# EAGLE design DCU (EAGLE 6.4)
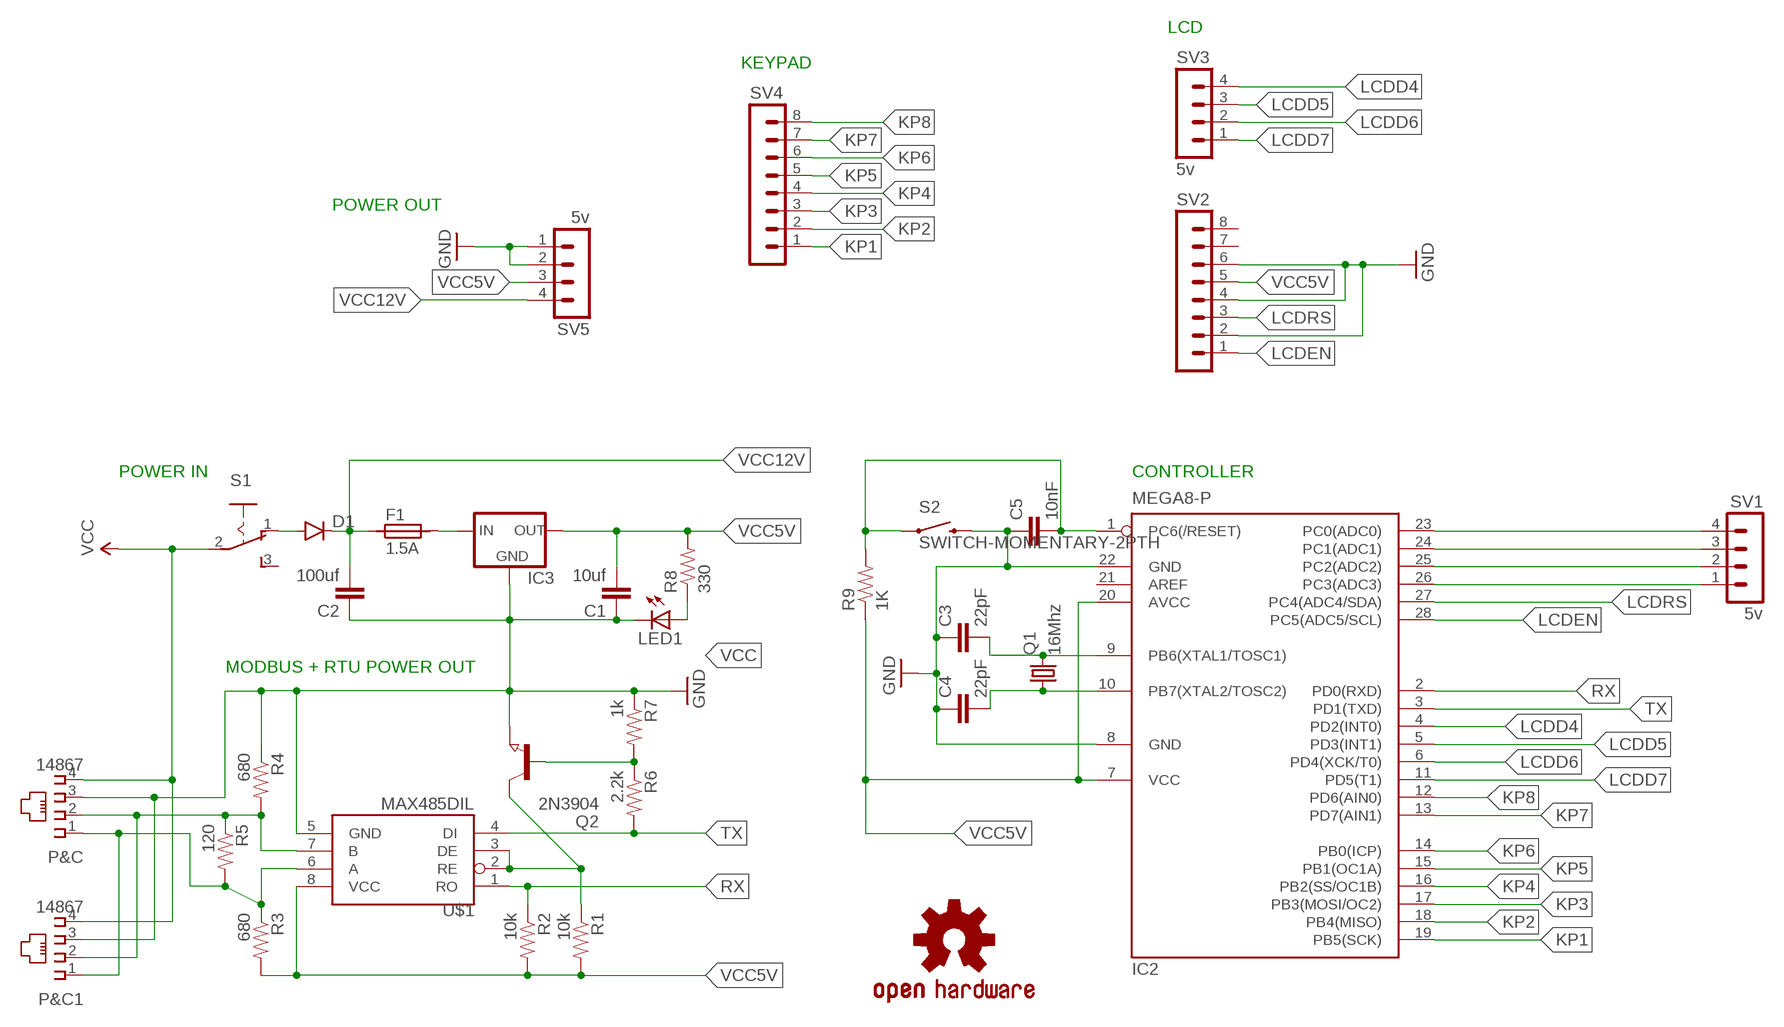
[diagram p0: schematic, sheet 1]

## Parts
C1  10uf  CAP0805  [0805]
C2  100uf  CAP0805  [0805]
C3  22pF  CAP0805  [0805]
C4  22pF  CAP0805  [0805]
C5  10nF  CAP0805  [0805]
D1  DIODESMA  [SMA-DIODE]
F1  1.5A  SIBA194600  [1820]
IC2  MEGA8-P  [DIL28-3]
IC3  V_REG_78XX-TO-220  [TO-220-ALT]
LED1  LEDCHIP-LED0805  [CHIP-LED0805]
LOGO1  OSHW-LOGOL  [OSHW-LOGO-L]
P&C  14867  [14867]
P&C1  14867  [14867]
Q1  16Mhz  CRYSTALSM49  [SM49]
Q2  2N3904  NPN-TRANSISTOR_SOT23  [SOT23]
R1  10k  RESISTOR0805-RES  [0805]
R2  10k  RESISTOR0805-RES  [0805]
R3  680  RESISTOR0805-RES  [0805]
R4  680  RESISTOR0805-RES  [0805]
R5  120  RESISTOR0805-RES  [0805]
R6  2.2k  RESISTOR0805-RES  [0805]
R7  1k  RESISTOR0805-RES  [0805]
R8  330  RESISTOR0805-RES  [0805]
R9  1K  RESISTOR0805-RES  [0805]
S1  255SB  [255SB]
S2  SWITCH-MOMENTARY-2PTH  [TACTILE-PTH]
SV1  5v  MA04-1  [MA04-1]
SV2  MA08-1  [MA08-1]
SV3  5v  MA04-1  [MA04-1]
SV4  MA08-1  [MA08-1]
SV5  5v  MA04-1  [MA04-1]
U$1  MAX485DIL  [DIL08]

## Nets
GND: C1.1 C2.1 C3.1 C4.1 C5.1 IC2.8(GND) IC2.22(GND) IC3.GND LED1.C P&C1.3 P&C.3 Q2.2(E) R4.1 R7.1 S2.3 SV2.2 SV2.4 SV2.6 SV5.1 SV5.2 U$1.5(GND)
KP1: IC2.19(PB5(SCK)) SV4.1
KP2: IC2.18(PB4(MISO)) SV4.2
KP3: IC2.17(PB3(MOSI/OC2)) SV4.3
KP4: IC2.16(PB2(SS/OC1B)) SV4.4
KP5: IC2.15(PB1(OC1A)) SV4.5
KP6: IC2.14(PB0(ICP)) SV4.6
KP7: IC2.13(PD7(AIN1)) SV4.7
KP8: IC2.12(PD6(AIN0)) SV4.8
LCDD4: IC2.4(PD2(INT0)) SV3.4
LCDD5: IC2.5(PD3(INT1)) SV3.3
LCDD6: IC2.6(PD4(XCK/T0)) SV3.2
LCDD7: IC2.11(PD5(T1)) SV3.1
LCDEN: IC2.28(PC5(ADC5/SCL)) SV2.1
LCDRS: IC2.27(PC4(ADC4/SDA)) SV2.3
N$1: F1.2 IC3.IN
N$2: Q2.3(C) R1.1 U$1.2(RE) U$1.3(DE)
N$4: Q2.1(B) R6.1 R7.2
N$5: IC2.26(PC3(ADC3)) SV1.1
N$7: P&C1.2 P&C.2 R4.2 R5.1 U$1.7(B)
N$8: P&C1.1 P&C.1 R3.1 R5.2 U$1.6(A)
N$11: LED1.A R8.1
N$13: D1.A S1.1(O)
N$15: IC2.25(PC2(ADC2)) SV1.2
N$16: IC2.24(PC1(ADC1)) SV1.3
N$17: IC2.23(PC0(ADC0)) SV1.4
N$21: C3.2 IC2.9(PB6(XTAL1/TOSC1)) Q1.2
N$23: C4.2 IC2.10(PB7(XTAL2/TOSC2)) Q1.1
N$24: C5.2 IC2.1(PC6(/RESET)) R9.2 S2.1
RX: IC2.2(PD0(RXD)) R2.1 U$1.1(RO)
TX: IC2.3(PD1(TXD)) R6.2 U$1.4(DI)
VCC: P&C1.4 P&C.4 S1.2(P)
VCC5V: C1.2 IC2.7(VCC) IC2.20(AVCC) IC3.OUT R1.2 R2.2 R3.2 R8.2 R9.1 SV2.5 SV5.3 U$1.8(VCC)
VCC12V: C2.2 D1.C F1.1 SV5.4
Unconnected: IC2.21(AREF) S1.3(S) SV2.7 SV2.8

## Notes on the sheet
- LCD
- KEYPAD
- POWER OUT
- POWER IN | CONTROLLER
- MODBUS + RTU POWER OUT

## Library data of the parts
C1-C5 = SparkFun-Capacitors:CAP: Capacitor Standard 0603 ceramic capacitor, and 0.1" leaded capacitor.
D1 = SparkFun-DiscreteSemi:DIODE: Diode These are standard reverse protection diodes and small signal diodes. SMA package can handle up to about 1A. SOD-323 can handle about 200mA. What the SOD-323 package when ordering, there are some mfgs out there that are 5-pin packages.
F1 = _hhn_PtcFuses_Siba_r500_Ozan:SIBA194600*: SIBA PTC-Fuses, Series 194600, 1812 (4.5 3.2)mm Source: www.siba.de/ Package: SMD 1812 (4.5 x 3.2)mm Technologies: SIBA194600Axxx xxx: Trip-Current * 10 mA Author: Dipl.-Ing. FH Rainer Bayer
IC2 = atmel:MEGA8-P: MICROCONTROLLER 8 Kbytes FLASH, 1 kbytes SRAM, 512 bytes EEPROM, USART, 4-channel 10 bit ADC, 2-channel 8 bit ADC Pin compatible with Atmega48, ATMega88, ATMega168 Source: avr.lbr; OC_FARNELL: unknown; OC_NEWARK: unknown
IC3 = SparkFun-PowerIC:V_REG_78XX: Voltage Regulator Standard 7805 5V regulator. IGO (Input Ground Output). Spark Fun Electronics SKU : COM-00107
LED1 = led:LED: LED OSRAM: - CHIPLED LG R971, LG N971, LY N971, LG Q971, LY Q971, LO R971, LY R971 LH N974, LH R974 LS Q976, LO Q976, LY Q976 LO Q996 - Hyper CHIPLED LW Q18S LB Q993, LB Q99A, LB R99A - SideLED LS A670, LO A670, LY A670, LG A670, LP A670 LB A673, LV A673, LT A673, LW A673 LH A674 LY A675 LS A676, LA A676, LO A676, LY A676, LW A676 LS A679, LY A679, LG A679 - Hyper Micro SIDELED® LS Y876, LA Y876, LO Y876, LY Y876 LT Y87S - SmartLED LW L88C, LW L88S LB L89C, LB L89S, LG L890 LS L89K, LO L89K, LY L89K LS L896, LA L896, LO L896, LY L896 - TOPLED LS T670, LO T670, LY T670, LG T670, LP T670 LSG T670, LSP T670, LSY T670, LOP T670, LYG T670 LG T671, LOG T671, LSG T671 LB T673, LV T673, LT T673, LW T673 LH T674 LS T676, LA T676, LO T676, LY T676, LB T676, LH T676, LSB T676, LW T676 LB T67C, LV T67C, LT T67C, LS T67K, LO T67K, LY T67K, LW E67C LS E67B, LA E67B, LO E67B, LY E67B, LB E67C, LV E67C, LT E67C LW T67C LS T679, LY T679, LG T679 LS T770, LO T770, LY T770, LG T770, LP T770 LB T773, LV T773, LT T773, LW T773 LH T774 LS E675, LA E675, LY E675, LS T675 LS T776, LA T776, LO T776, LY T776, LB T776 LHGB T686 LT T68C, LB T68C - Hyper Mini TOPLED® LB M676 - Mini TOPLED Santana® LG M470 LS M47K, LO M47K, LY M47K Source: http://www.osram.convergy.de LUXEON: - LUMILED® LXK2-PW12-R00, LXK2-PW12-S00, LXK2-PW14-U00, LXK2-PW14-V00 LXK2-PM12-R00, LXK2-PM12-S00, LXK2-PM14-U00 LXK2-PE12-Q00, LXK2-PE12-R00, LXK2-PE12-S00, LXK2-PE14-T00, LXK2-PE14-U00 LXK2-PB12-K00, LXK2-PB12-L00, LXK2-PB12-M00, LXK2-PB14-N00, LXK2-PB14-P00, LXK2-PB14-Q00 LXK2-PR12-L00, LXK2-PR12-M00, LXK2-PR14-Q00, LXK2-PR14-R00 LXK2-PD12-Q00, LXK2-PD12-R00, LXK2-PD12-S00 LXK2-PH12-R00, LXK2-PH12-S00 LXK2-PL12-P00, LXK2-PL12-Q00, LXK2-PL12-R00 Source: www.luxeon.com KINGBRIGHT: KA-3528ASYC Source: www.kingbright.com
LOGO1 = SparkFun-Aesthetics:OSHW-LOGO: Open Source Hardware Logo This logo indicates the piece of hardware it is found on incorporates a OSHW license and/or adheres to the definition of open source hardware found here: http://freedomdefined.org/OSHW
P&C P&C1 = con-4ucon:14867: RJ11 Connector Source: 4UCON TECHNOLOGY INC. 14867.pdf; OC_FARNELL: unknown; OC_NEWARK: unknown
Q1 = crystal:CRYSTAL: CRYSTAL; OC_FARNELL: unknown; OC_NEWARK: unknown
Q2 = semicon-smd-ipc:NPN-TRANSISTOR_: NPN TRANSISTOR
R1-R9 = SparkFun-Passives:RESISTOR: Resistor Basic schematic elements and footprints for 0603, 1206, and PTH resistors.
S1 = switch:255SB: SLIDING SWITCH Distributor Buerklin, 11G810
S2 = SparkFun-Electromechanical:SWITCH-MOMENTARY-2: Various NO switches- pushbuttons, reed, etc
SV1 SV3 SV5 = con-lstb:MA04-1: PIN HEADER; OC_FARNELL: unknown; OC_NEWARK: unknown
SV2 SV4 = con-lstb:MA08-1: PIN HEADER; OC_FARNELL: unknown; OC_NEWARK: unknown
U$1 = SparkFun-DigitalIC:MAX485: RS-485 transceiver

## Net classes
0 default: width 0.3 mm, drill 0.5 mm, clearance 0.25 mm

## Board
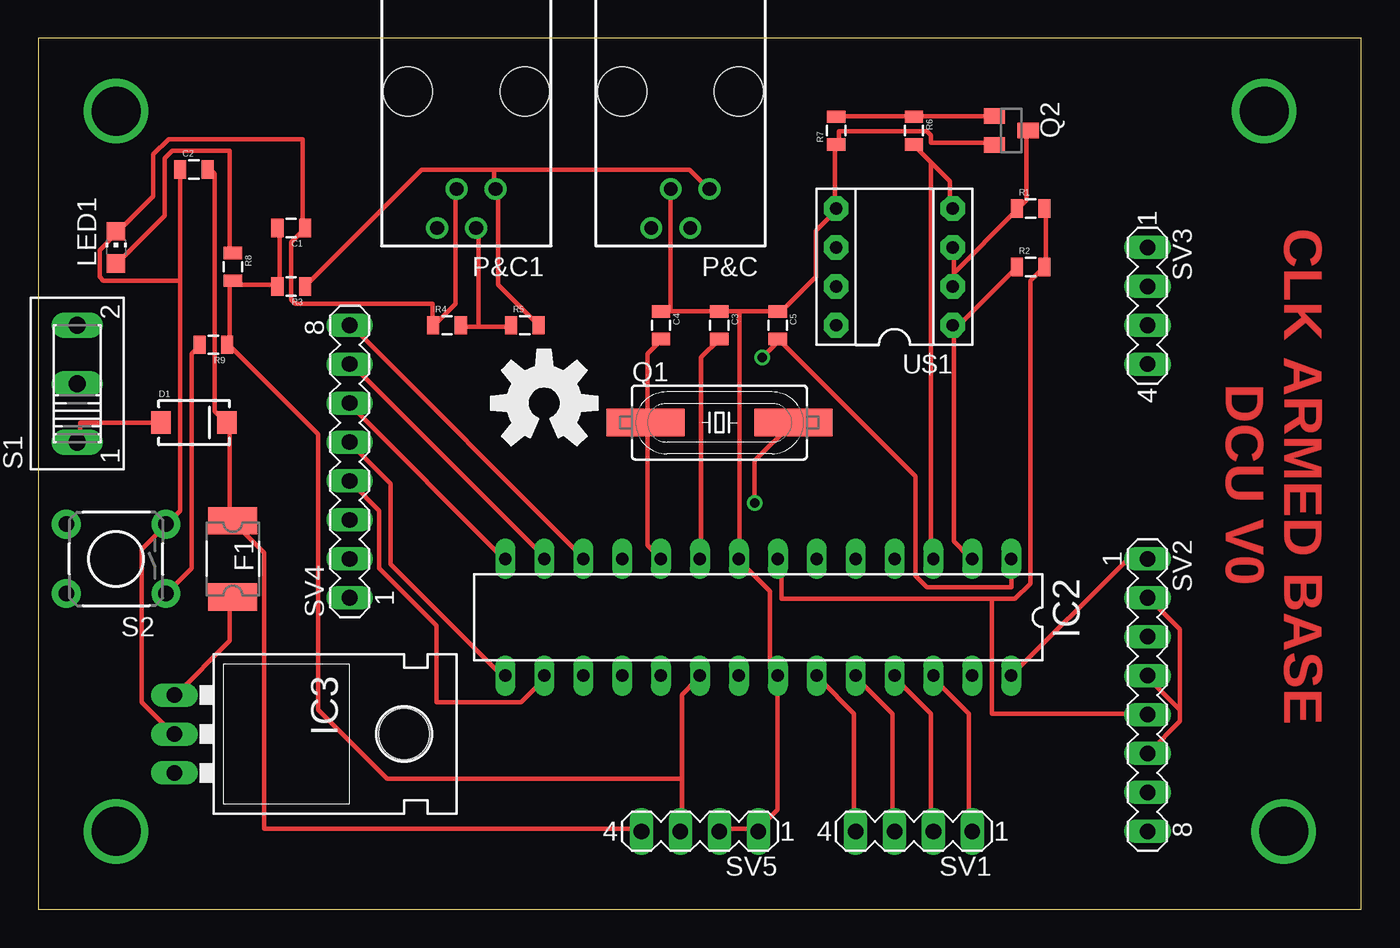
[diagram p1: board, top side]
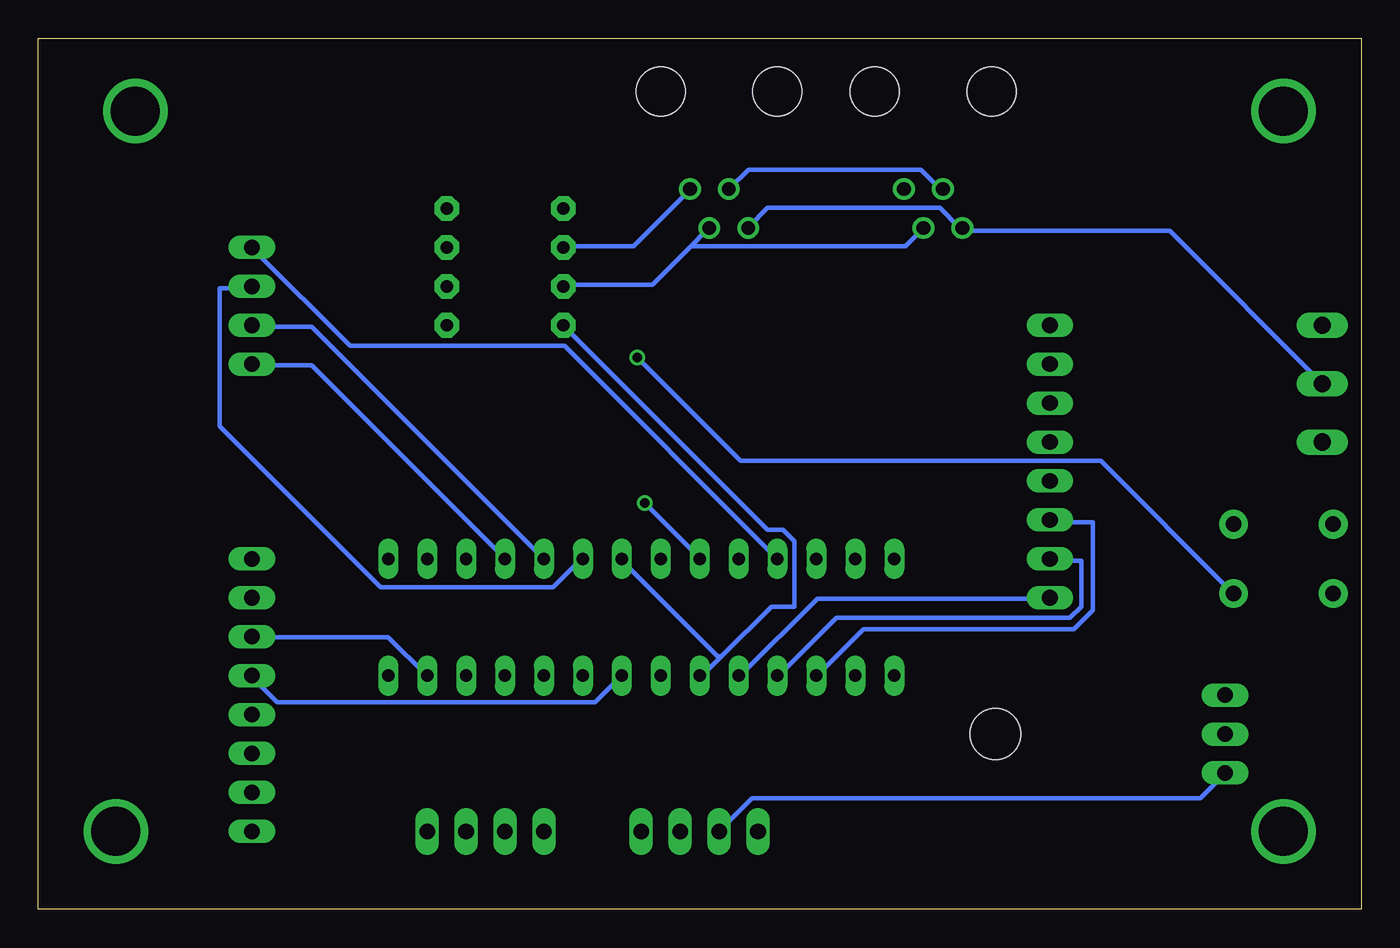
[diagram p2: board, bottom side, seen from below]

Size 86.34 x 56.82 mm. Coordinates in mm from the lower left corner, seen from the top.
Outline: 0,0 86.34,0 86.34,56.82 0,56.82 0,0
Copper layers (1*16): Top 0.035mm / dielectric 1.5mm / Bottom 0.035mm
Design rules "default": minimum track width 10mil, minimum drill 24mil, track to track 8mil, track to pad 8mil, pad to pad 8mil, via to via 8mil, smd to smd 8mil, copper to edge 40mil, drill to drill 8mil, minimum pad ring 10mil, minimum via ring 8mil, stop-mask expansion 4mil, vias tented up to drill 0mil, thermal gap 10mil

### Footprints (pad centres in the part's own frame; a part is rotated, then mirrored left to right if it is on the bottom)
0805 = smd 0.8 x 1.2: 1 -0.9,0; 2 0.9,0
SMA-DIODE = smd 1.27 x 1.47: A -2.15,0; C 2.15,0
1820 = smd 1.78 x 3.2: 1 -2.49,0; 2 2.49,0
DIL28-3 = drill 0.813 long: 1 -16.51,-3.81; 2 -13.97,-3.81; 3 -11.43,-3.81; 4 -8.89,-3.81; 5 -6.35,-3.81; 6 -3.81,-3.81; 7 -1.27,-3.81; 8 1.27,-3.81; 9 3.81,-3.81; 10 6.35,-3.81; 11 8.89,-3.81; 12 11.43,-3.81; 13 13.97,-3.81; 14 16.51,-3.81; 15 16.51,3.81; 16 13.97,3.81; 17 11.43,3.81; 18 8.89,3.81; 19 6.35,3.81; 20 3.81,3.81; 21 1.27,3.81; 22 -1.27,3.81; 23 -3.81,3.81; 24 -6.35,3.81; 25 -8.89,3.81; 26 -11.43,3.81; 27 -13.97,3.81; 28 -16.51,3.81
TO-220-ALT = drill 1.016 long: GND 0,-3.81; IN -2.54,-3.81; OUT 2.54,-3.81 | hole 3.302: 0,11.176
CHIP-LED0805 = smd 1.2 x 1.2: A 0,-1.05; C 0,1.05
14867 = drill 0.9 pad 1.422: 1 -1.905,6.35; 2 -0.635,8.89; 3 0.635,6.35; 4 1.905,8.89 | hole 3.2: -3.81,0; 3.81,0
SM49 = smd 5.08 x 1.778: 1 -4.826,0; 2 4.826,0
SOT23 = smd 1 x 1.4: 1 -0.95,-1.1; 2 0.95,-1.1; 3 0,1.1
255SB = drill 1.118 long: 1 -3.81,0; 2 0,0; 3 3.81,0
TACTILE-PTH = drill 1.016 pad 1.88: 1 -3.251,2.261; 2 3.251,2.261; 3 -3.251,-2.261; 4 3.251,-2.261
MA04-1 = drill 1.016 long: 1 -3.81,0; 2 -1.27,0; 3 1.27,0; 4 3.81,0
MA08-1 = drill 1.016 long: 1 -8.89,0; 2 -6.35,0; 3 -3.81,0; 4 -1.27,0; 5 1.27,0; 6 3.81,0; 7 6.35,0; 8 8.89,0
DIL08 = drill 0.813 pad 1.6 octagon: 1 -3.81,-3.81; 2 -1.27,-3.81; 3 1.27,-3.81; 4 3.81,-3.81; 5 3.81,3.81; 6 1.27,3.81; 7 -1.27,3.81; 8 -3.81,3.81

### Placement (x,y rotation side)
C1  16.51,44.45 180 top
C2  10.16,48.26 0 top
C3  44.45,38.1 270 top
C4  40.64,38.1 270 top
C5  48.26,38.1 270 top
D1  10.16,31.75 0 top
F1  12.7,22.86 270 top
IC2  46.99,19.05 180 top
IC3  12.7,11.43 270 top
LED1  5.08,43.18 0 top
LOGO1  33.02,33.02 0 top
P&C  41.91,53.34 180 top
P&C1  27.94,53.34 180 top
Q1  44.45,31.75 0 top
Q2  63.5,50.8 270 top
R1  64.77,45.72 0 top
R2  64.77,41.91 0 top
R3  16.51,40.64 180 top
R4  26.67,38.1 0 top
R5  31.75,38.1 0 top
R6  57.15,50.8 270 top
R7  52.07,50.8 90 top
R8  12.7,41.91 270 top
R9  11.43,36.83 180 top
S1  2.54,34.29 90 top
S2  5.08,22.86 180 top
SV1  57.15,5.08 180 top
SV2  72.39,13.97 270 top
SV3  72.39,39.37 270 top
SV4  20.32,29.21 90 top
SV5  43.18,5.08 180 top
U$1  55.88,41.91 90 top

### Tracks (layer width: path | path; a pad name or v marks a point on that pad's centre or on a via)
GND
  Top 0.3: 74.5,13 74.5,12.25 72.5,10.25 SV2.6 | 74.5,13 72.5,15 SV2.4 | 74.5,13 74.5,18.25 72.5,20.25 SV2.2 | SV5.2 44.5,5.25 46.75,5.25 SV5.1 47,5.25 48.25,6.5 48.25,15 IC2.22 47.75,15.75 47.75,20.75 45.75,22.75 IC2.8 45.75,23 45.75,39 | 9.25,41 4.25,41 4,41.25 4,43 5,44 LED1.C 5.25,44.25 7.5,46.5 7.5,49.25 8.5,50.25 17.25,50.25 17.25,44.5 C1.1 17.25,44.25 16.5,43.5 16.5,39.75 16.75,39.5 25.75,39.5 25.75,38.25 R4.1 26,38.25 27.25,39.5 27.25,46.75 P&C1.3 | 9.25,41 C2.1 | IC3.GND 8.75,11.5 6.75,13.5 6.75,23.5 8.25,25 S2.3 8.5,25.25 9.25,26 9.25,41 | 41.25,39 C3.1 45.75,39 | 41.25,39 C4.1 | 45.75,39 C5.1 48.5,39 50.75,41.25 50.75,44.25 52,45.5 U$1.5 52,45.75 52,49.75 R7.1 52.25,50 52.25,50.75 58,50.75 58.25,50.5 58.25,50 62.25,50 Q2.2 | 41.25,39 41.25,46.75 P&C.3
  Bottom 0.3: IC2.22 50,13.5 70.75,13.5 72.25,15 SV2.4 | P&C1.3 27.5,47 28.75,48.25 40,48.25 41.25,47 P&C.3
KP1
  Bottom 0.3: IC2.19 40.5,15.25 35.5,20.25 20.5,20.25 SV4.1
KP2
  Bottom 0.3: IC2.18 38,15.25 34.25,19 19,19 18.25,19.75 18.25,22.75 20.25,22.75 SV4.2
KP3
  Bottom 0.3: IC2.17 35.5,15.25 32.5,18.25 18.75,18.25 17.5,19.5 17.5,25.25 20.25,25.25 SV4.3
KP4
  Top 0.3: IC2.16 33,15 31.5,13.5 26,13.5 26,18.5 22.25,22.25 22.25,26 20.5,27.75 SV4.4
KP5
  Top 0.3: IC2.15 30.25,15.25 23,22.5 23,27.75 20.5,30.25 SV4.5
KP6
  Top 0.3: IC2.14 30.25,23 20.5,32.75 20.5,33 SV4.6
KP7
  Top 0.3: IC2.13 33,23 20.5,35.5 SV4.7
KP8
  Top 0.3: IC2.12 35.5,23 20.5,38 SV4.8
LCDD4
  Bottom 0.3: IC2.4 56,23 68.5,35.5 72.25,35.5 SV3.4
LCDD5
  Bottom 0.3: IC2.5 53.5,23 68.5,38 72.25,38 SV3.3
LCDD6
  Bottom 0.3: IC2.6 51,22.75 52.75,21 64,21 74.5,31.5 74.5,40.5 72.5,40.5 SV3.2
LCDD7
  Bottom 0.3: IC2.11 38.25,23 52,36.75 66,36.75 72.25,43 SV3.1
LCDEN
  Top 0.3: IC2.28 71,22.75 72.25,22.75 SV2.1
LCDRS
  Bottom 0.3: IC2.27 61,15.25 63.5,17.75 72.25,17.75 SV2.3
N$1
  Top 0.3: IC3.IN 9,14 12.5,17.5 12.5,20.25 F1.2
N$2
  Top 0.3: Q2.3 64.5,50.75 64.5,46.25 64,45.75 R1.1 63.75,45.5 59.75,41.5 | 59.75,41.5 59.75,43 U$1.3 | 59.75,41.5 59.75,40.75 U$1.2
N$3  (via drill 3.2 pad 1.68)
  other vias: 5.08,52.07
N$4
  Top 0.3: R7.2 52.25,51.75 57,51.75 R6.1 57.25,51.75 Q2.1
N$5
  Top 0.3: IC2.26 58.5,15 60.75,12.75 60.75,5.25 SV1.1
N$7
  Top 0.3: 28.75,38 30.75,38 R5.1 | 28.75,38 27.75,38 R4.2 | 28.75,38 28.75,44.25 P&C1.2
  Bottom 0.3: 43.75,43.25 46.25,40.75 52,40.75 U$1.7 | 43.75,43.25 42.75,44.25 P&C.2 | 43.75,43.25 29.75,43.25 28.75,44.25 P&C1.2
N$8
  Top 0.3: R5.2 30,40.75 30,46.75 P&C1.1 29.75,47 29.75,48.25 | 29.75,48.25 25,48.25 17.5,40.75 R3.1 | 29.75,48.25 42.5,48.25 43.75,47 P&C.1
  Bottom 0.3: P&C.1 44,46.75 47.5,43.25 52,43.25 U$1.6
N$10  (via drill 3.2 pad 1.68)
  other vias: 5.08,5.08
N$11
  Top 0.3: LED1.A 5.25,42.25 8.25,45.25 8.25,49 8.75,49.5 12.5,49.5 12.5,43 R8.1
N$12  (via drill 3.2 pad 1.68)
  other vias: 80.01,52.07
N$13
  Top 0.3: D1.A 2.75,31.75 2.75,30.5 S1.1
N$14  (via drill 3.2 pad 1.68)
  other vias: 81.28,5.08
N$15
  Top 0.3: IC2.25 56,15 58.25,12.75 58.25,5.25 SV1.2
N$16
  Top 0.3: IC2.24 53.5,15 55.75,12.75 55.75,5.25 SV1.3
N$17
  Top 0.3: IC2.23 51,15 53.25,12.75 53.25,5.25 SV1.4
N$21  (via drill 0.61)
  Top 0.3: C3.2 43.25,36 43.25,23 IC2.9 | v46.75,26.5 46.75,29.25 49.25,31.75 Q1.2
  Bottom 0.3: v46.75,26.5 43.25,23 IC2.9
N$23
  Top 0.3: 39.75,31.75 39.75,36.25 40.5,37 C4.2 | IC2.10 39.75,23.75 39.75,31.75 | 39.75,31.75 Q1.1
N$24  (via drill 0.61)
  Top 0.3: R9.2 10.5,36.75 10,36.25 10,22.25 8.5,20.75 S2.1 | IC2.1 63.5,21 58,21 57.25,21.75 57.25,28.25 48.5,37 C5.2 48.25,37 v47.25,36
  Bottom 0.3: v47.25,36 40.5,29.25 17,29.25 8.5,20.75 S2.1
RX
  Top 0.3: R2.1 63.75,41.75 60.25,38.25 59.75,38.25 U$1.1 59.75,38 59.75,24 60.75,23 IC2.2
TX
  Top 0.3: 58.25,48.75 59.5,47.5 59.5,45.75 U$1.4 | 58.25,48.75 57.25,49.75 R6.2 | 58.25,48.75 58.25,23 IC2.3
VCC
  Bottom 0.3: P&C.4 40,44.5 38.75,45.75 27.5,45.75 26.25,44.5 P&C1.4 26,44.25 12.5,44.25 S1.2
VCC5V
  Top 0.3: R1.2 65.75,45.5 65.75,42 R2.2 65.5,41.75 64.75,41 64.75,21.25 63.75,20.25 62.25,20.25 | 62.25,20.25 48.5,20.25 48.5,22.75 IC2.7 | 62.25,20.25 62.25,12.75 72.25,12.75 SV2.5 | 12.5,40.75 12.5,41 R8.2 12.5,40.75 | 12.5,40.75 12.5,37 R9.1 12.5,36.75 18.25,31 18.25,13 22.75,8.5 42,8.5 | 12.5,40.75 15.5,40.75 R3.2 15.75,40.75 15.75,44.25 C1.2 | 42,8.5 42,5.25 SV5.3 | 42,8.5 42,14 43,15 IC2.20
  Bottom 0.3: IC3.OUT 9,8.75 10.5,7.25 39.75,7.25 41.75,5.25 SV5.3 | 41.75,16.5 43,15.25 IC2.20 | 41.75,16.5 38.5,19.75 37,19.75 37,24 37.75,24.75 38.75,24.75 52,38 U$1.8 | 41.75,16.5 42,16.5 48.25,22.75 IC2.7
VCC12V
  Top 0.3: C2.2 11.25,48.25 11.5,48 11.5,32.5 12.25,31.75 D1.C 12.5,31.75 12.5,25.5 F1.1 12.75,25.25 14.75,23.25 14.75,5.25 39.25,5.25 SV5.4

### Text on the board
Top: CLK ARMED BASE | DCU V0